# Altium schematic sheet fpga_power.SchDoc
size A4
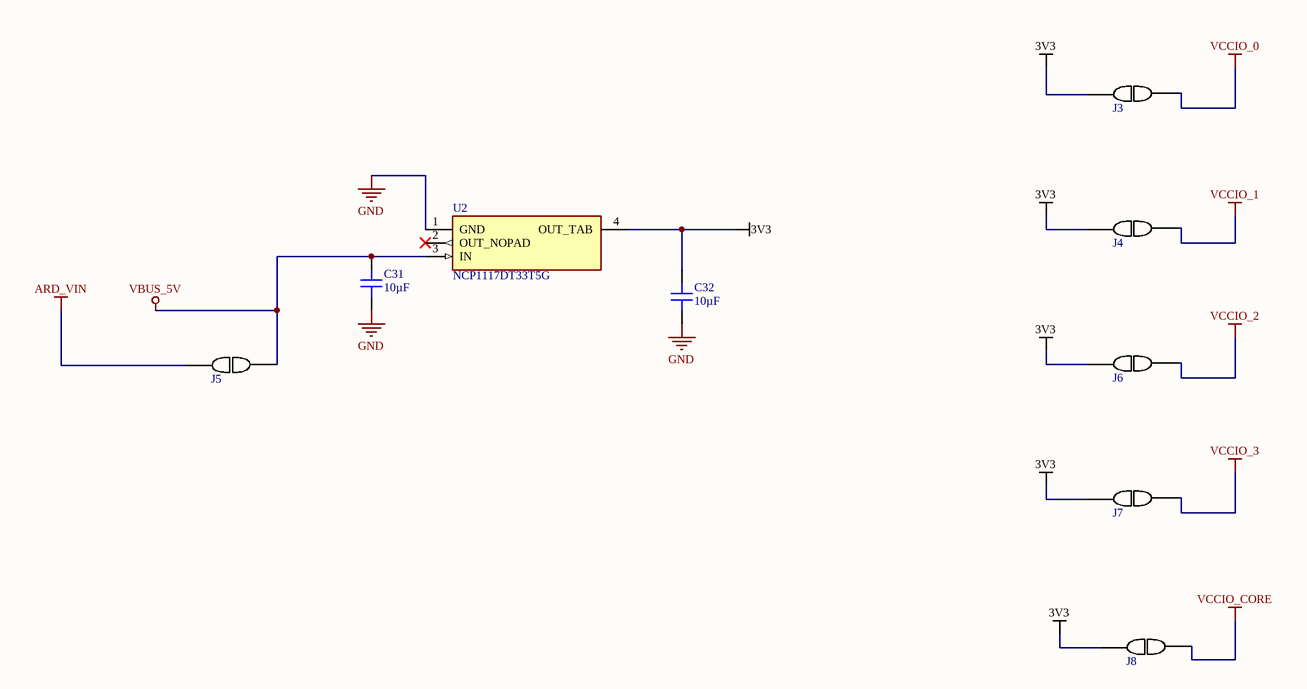
[diagram p0: fpga_power.SchDoc]

## Parts
C31  10µF  [CAP 0603_1608]
C32  10µF  [CAP 0603_1608]
J3  103185-2  [TE_103185-2]  (value not drawn)
J4  103185-2  [TE_103185-2]  (value not drawn)
J5  103185-2  [TE_103185-2]  (value not drawn)
J6  103185-2  [TE_103185-2]  (value not drawn)
J7  103185-2  [TE_103185-2]  (value not drawn)
J8  103185-2  [TE_103185-2]  (value not drawn)
U2  NCP1117DT33T5G  [TO229P990X238-4N]

## Nets
3V3: C32.1 J3.1 J4.1 J6.1 J7.1 J8.1 U2.4(OUT_TAB)
ARD_VIN: J5.2
GND: C31.1 C32.2 U2.1(GND)
VBUS_5V: C31.2 J5.1 U2.3(IN)
VCCIO_0: J3.2
VCCIO_1: J4.2
VCCIO_2: J6.2
VCCIO_3: J7.2
VCCIO_CORE: J8.2

Not connected (* = marked no-connect by the designer): U2 2(OUT_NOPAD)*

## Library data of the parts
C31 C32 = GRT188R61C106KE13D: CAP CER 10UF 16V X5R 0603; Manufacturer: Murata Electronics; Tolerance: ±10%; Part Number: GRT188R61C106KE13D; Value: 10µF; Applications: Automotive; Capacitance: 10µF; ComponentLink1Description: Datasheet; ComponentLink1URL: https://search.murata.co.jp/Ceramy/image/img/A01X/G101/ENG/GRT188R61C106KE13-01.pdf; ComponentLink2Description: DigiKey Link; ComponentLink2URL: http://digikey.com/product-detail/en/murata-electronics/GRT188R61C106KE13D/490-12317-1-ND/5417018; Device Package: 0603 (1608 Metric); LastUpdated: 02.09.2020 1:03:11; Lifecycle Status: Active; Minimum Order: 1; Mounting Type: Surface Mount, MLCC; Operating Temperature: -55°C ~ 85°C; Package / Case: 0603 (1608 Metric); Packaging: TapeAndReel; PartId: 14922; Part Status: Active; Price: 0.10; Ratings: AEC-Q200; Series: GRT; Size / Dimension: 0.063" L x 0.031" W (1.60mm x 0.80mm); Supplier 1: DigiKey; Supplier Part Number 1: 490-12317-1-ND; Temperature Coefficient: X5R; Thickness (Max): 0.035" (0.90mm); Voltage - Rated: 16V
J3-J8 = 103185-2: 02 MODII HDR SRST B/A .100CL; Package: None; Price: None; Value: *; MP: 103185-2; Availability: Unavailable
U2 = NCP1117DT33T5G: Integrated Circuit; Manufacturer_Name: ON Semiconductor; Datasheet Link: http://www.onsemi.com/pub/Collateral/NCP1117-D.PDF; Height: 2.38mm; Manufacturer_Part_Number: NCP1117DT33T5G; Mouser Part Number: 863-NCP1117DT33T5G; Mouser Price/Stock: https://www.mouser.co.uk/ProductDetail/ON-Semiconductor/NCP1117DT33T5G/?qs=Gev%252BmEvV0ibY9yFNc3ZYyw%3D%3D; Arrow Part Number: NCP1117DT33T5G; Arrow Price/Stock: https://www.arrow.com/en/products/ncp1117dt33t5g/on-semiconductor